# Altium schematic sheet FPGA.SchDoc
size A0
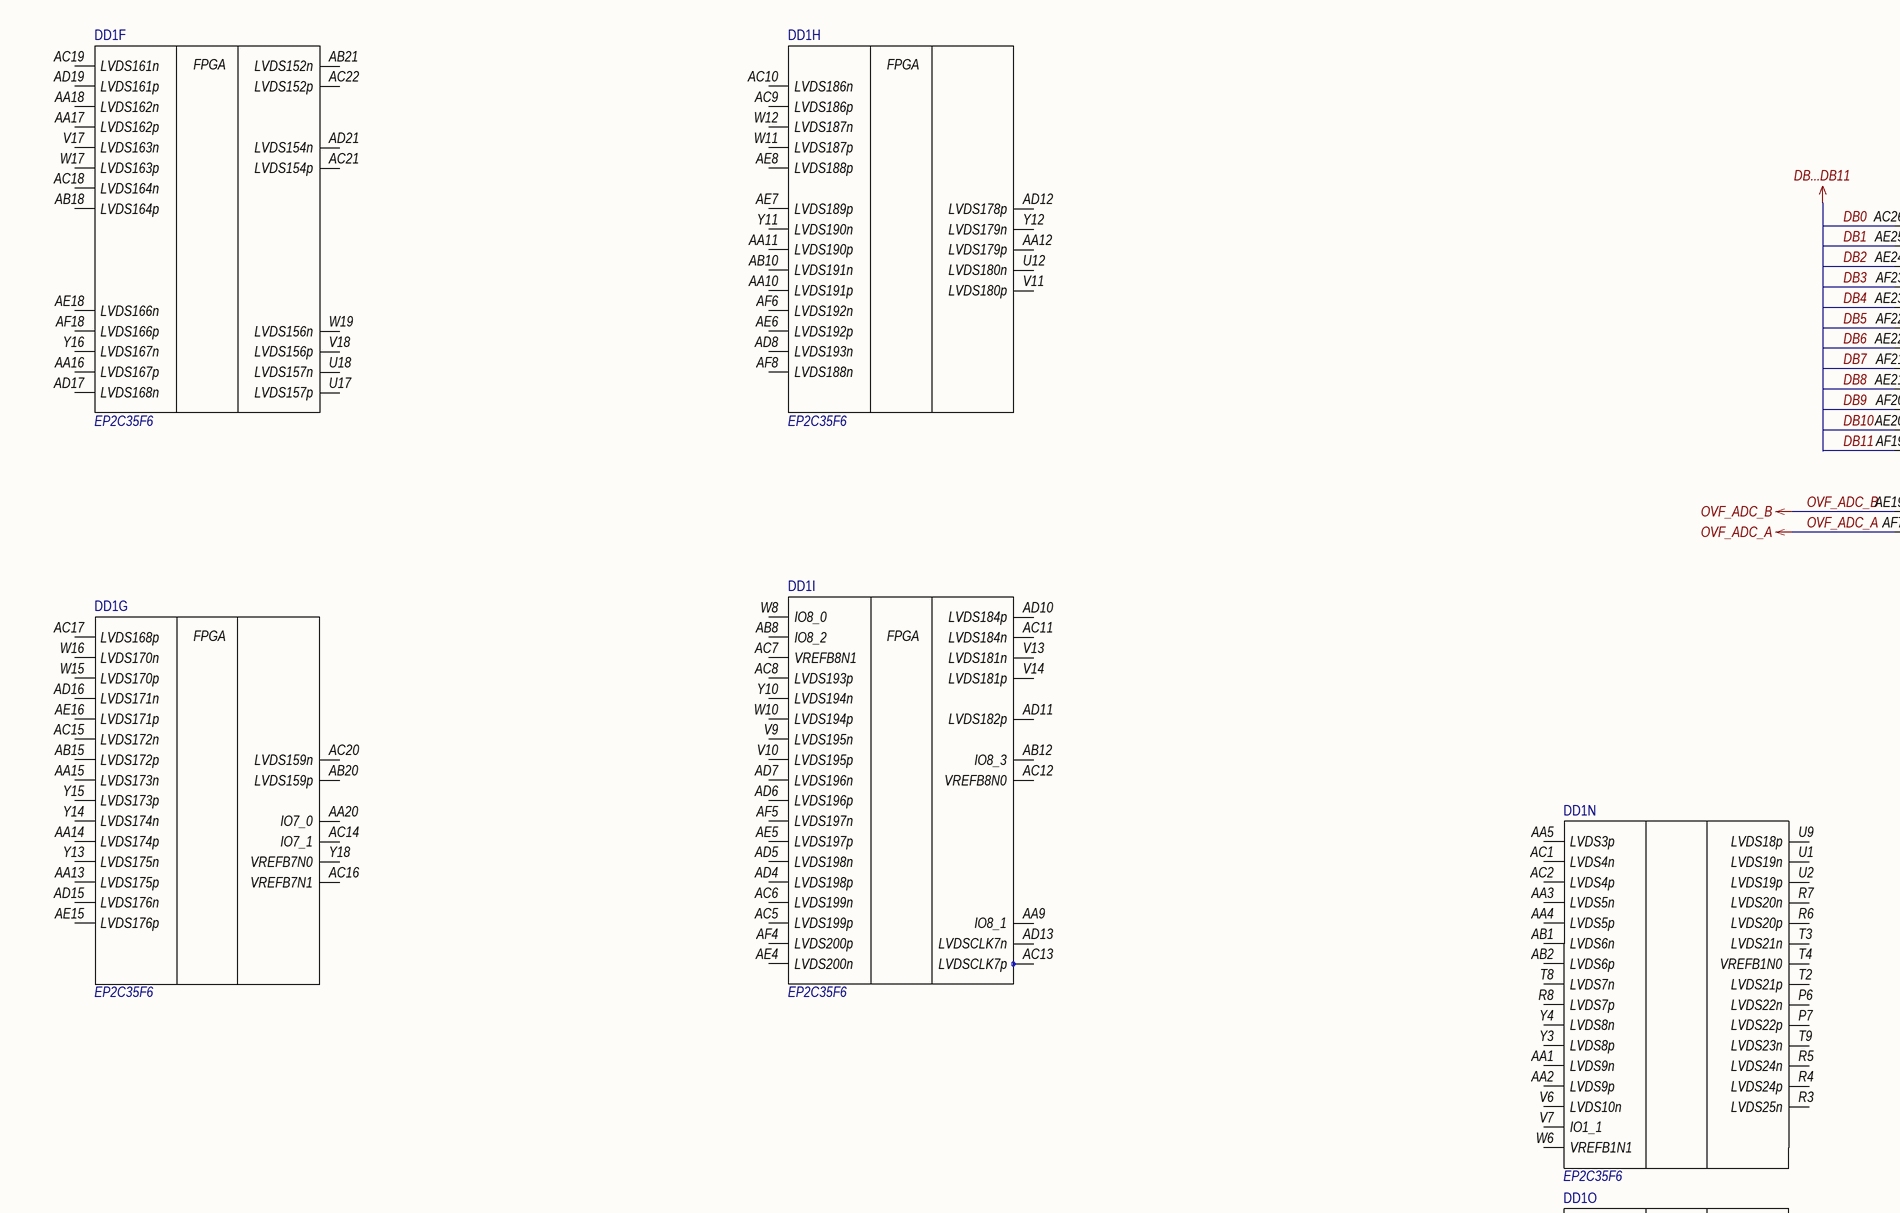
[diagram p0: FPGA.SchDoc, top left]
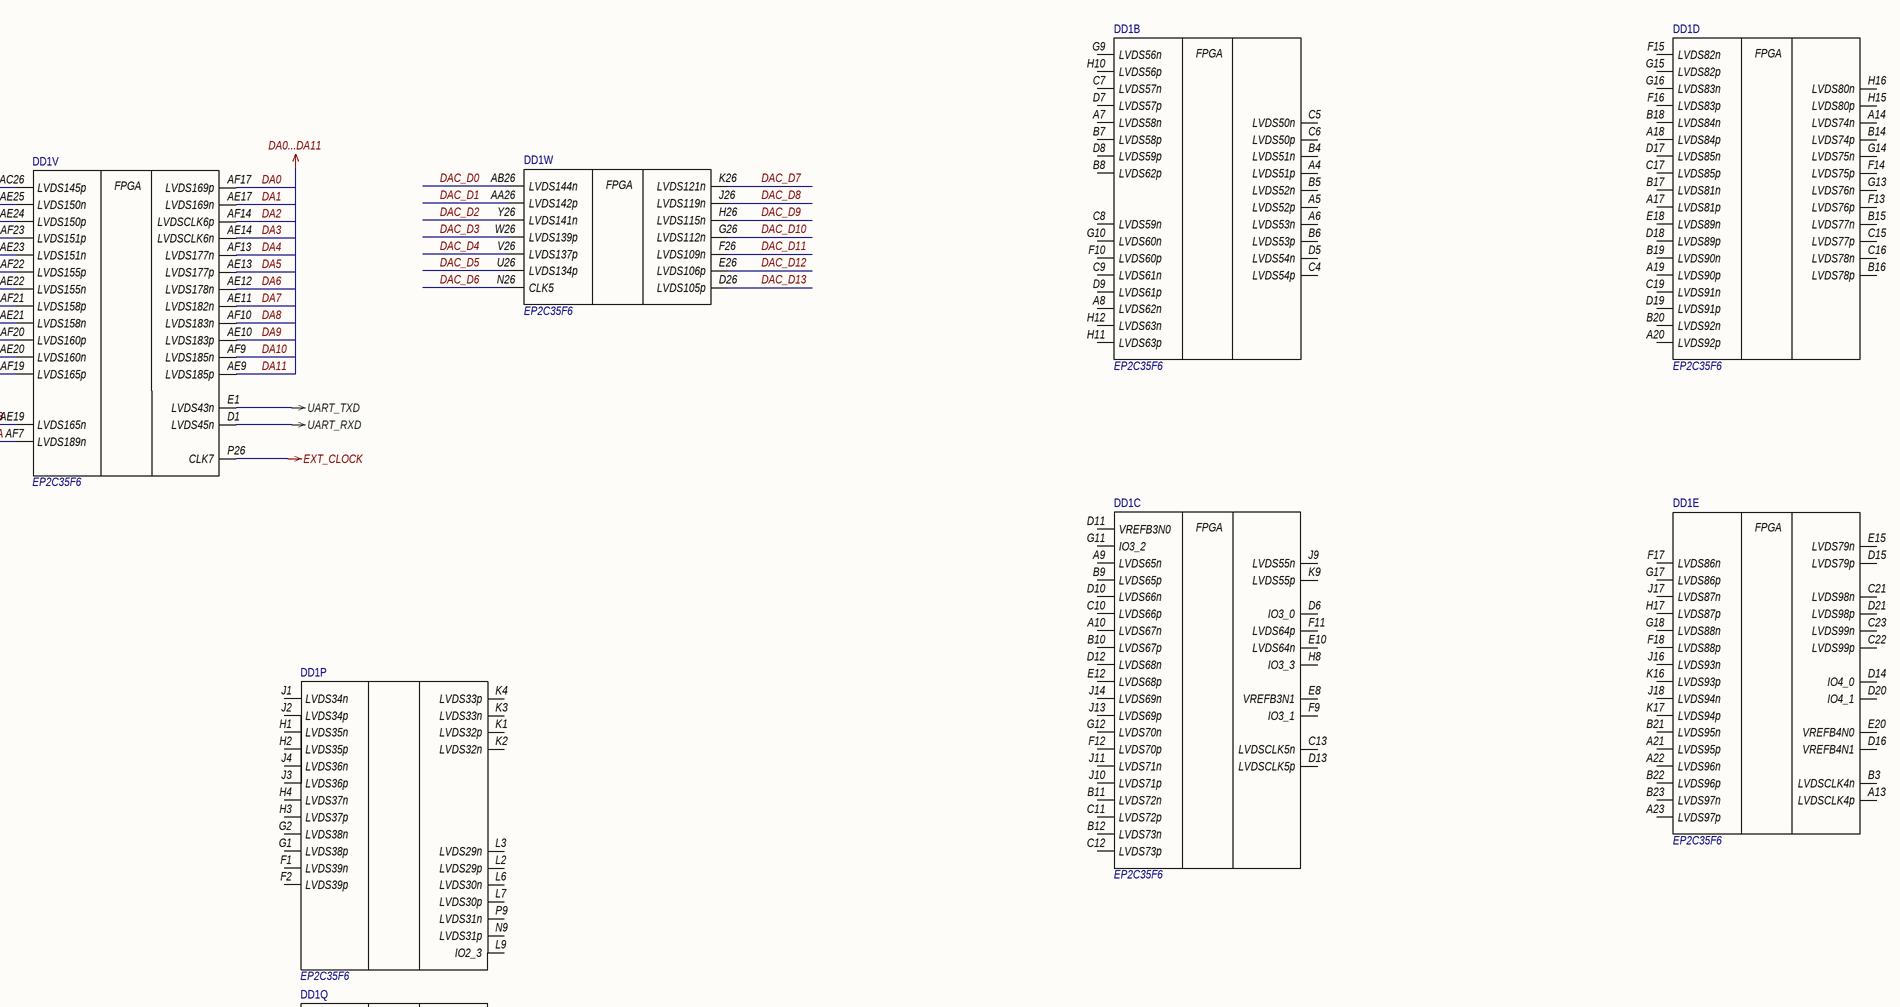
[diagram p1: FPGA.SchDoc, top right]
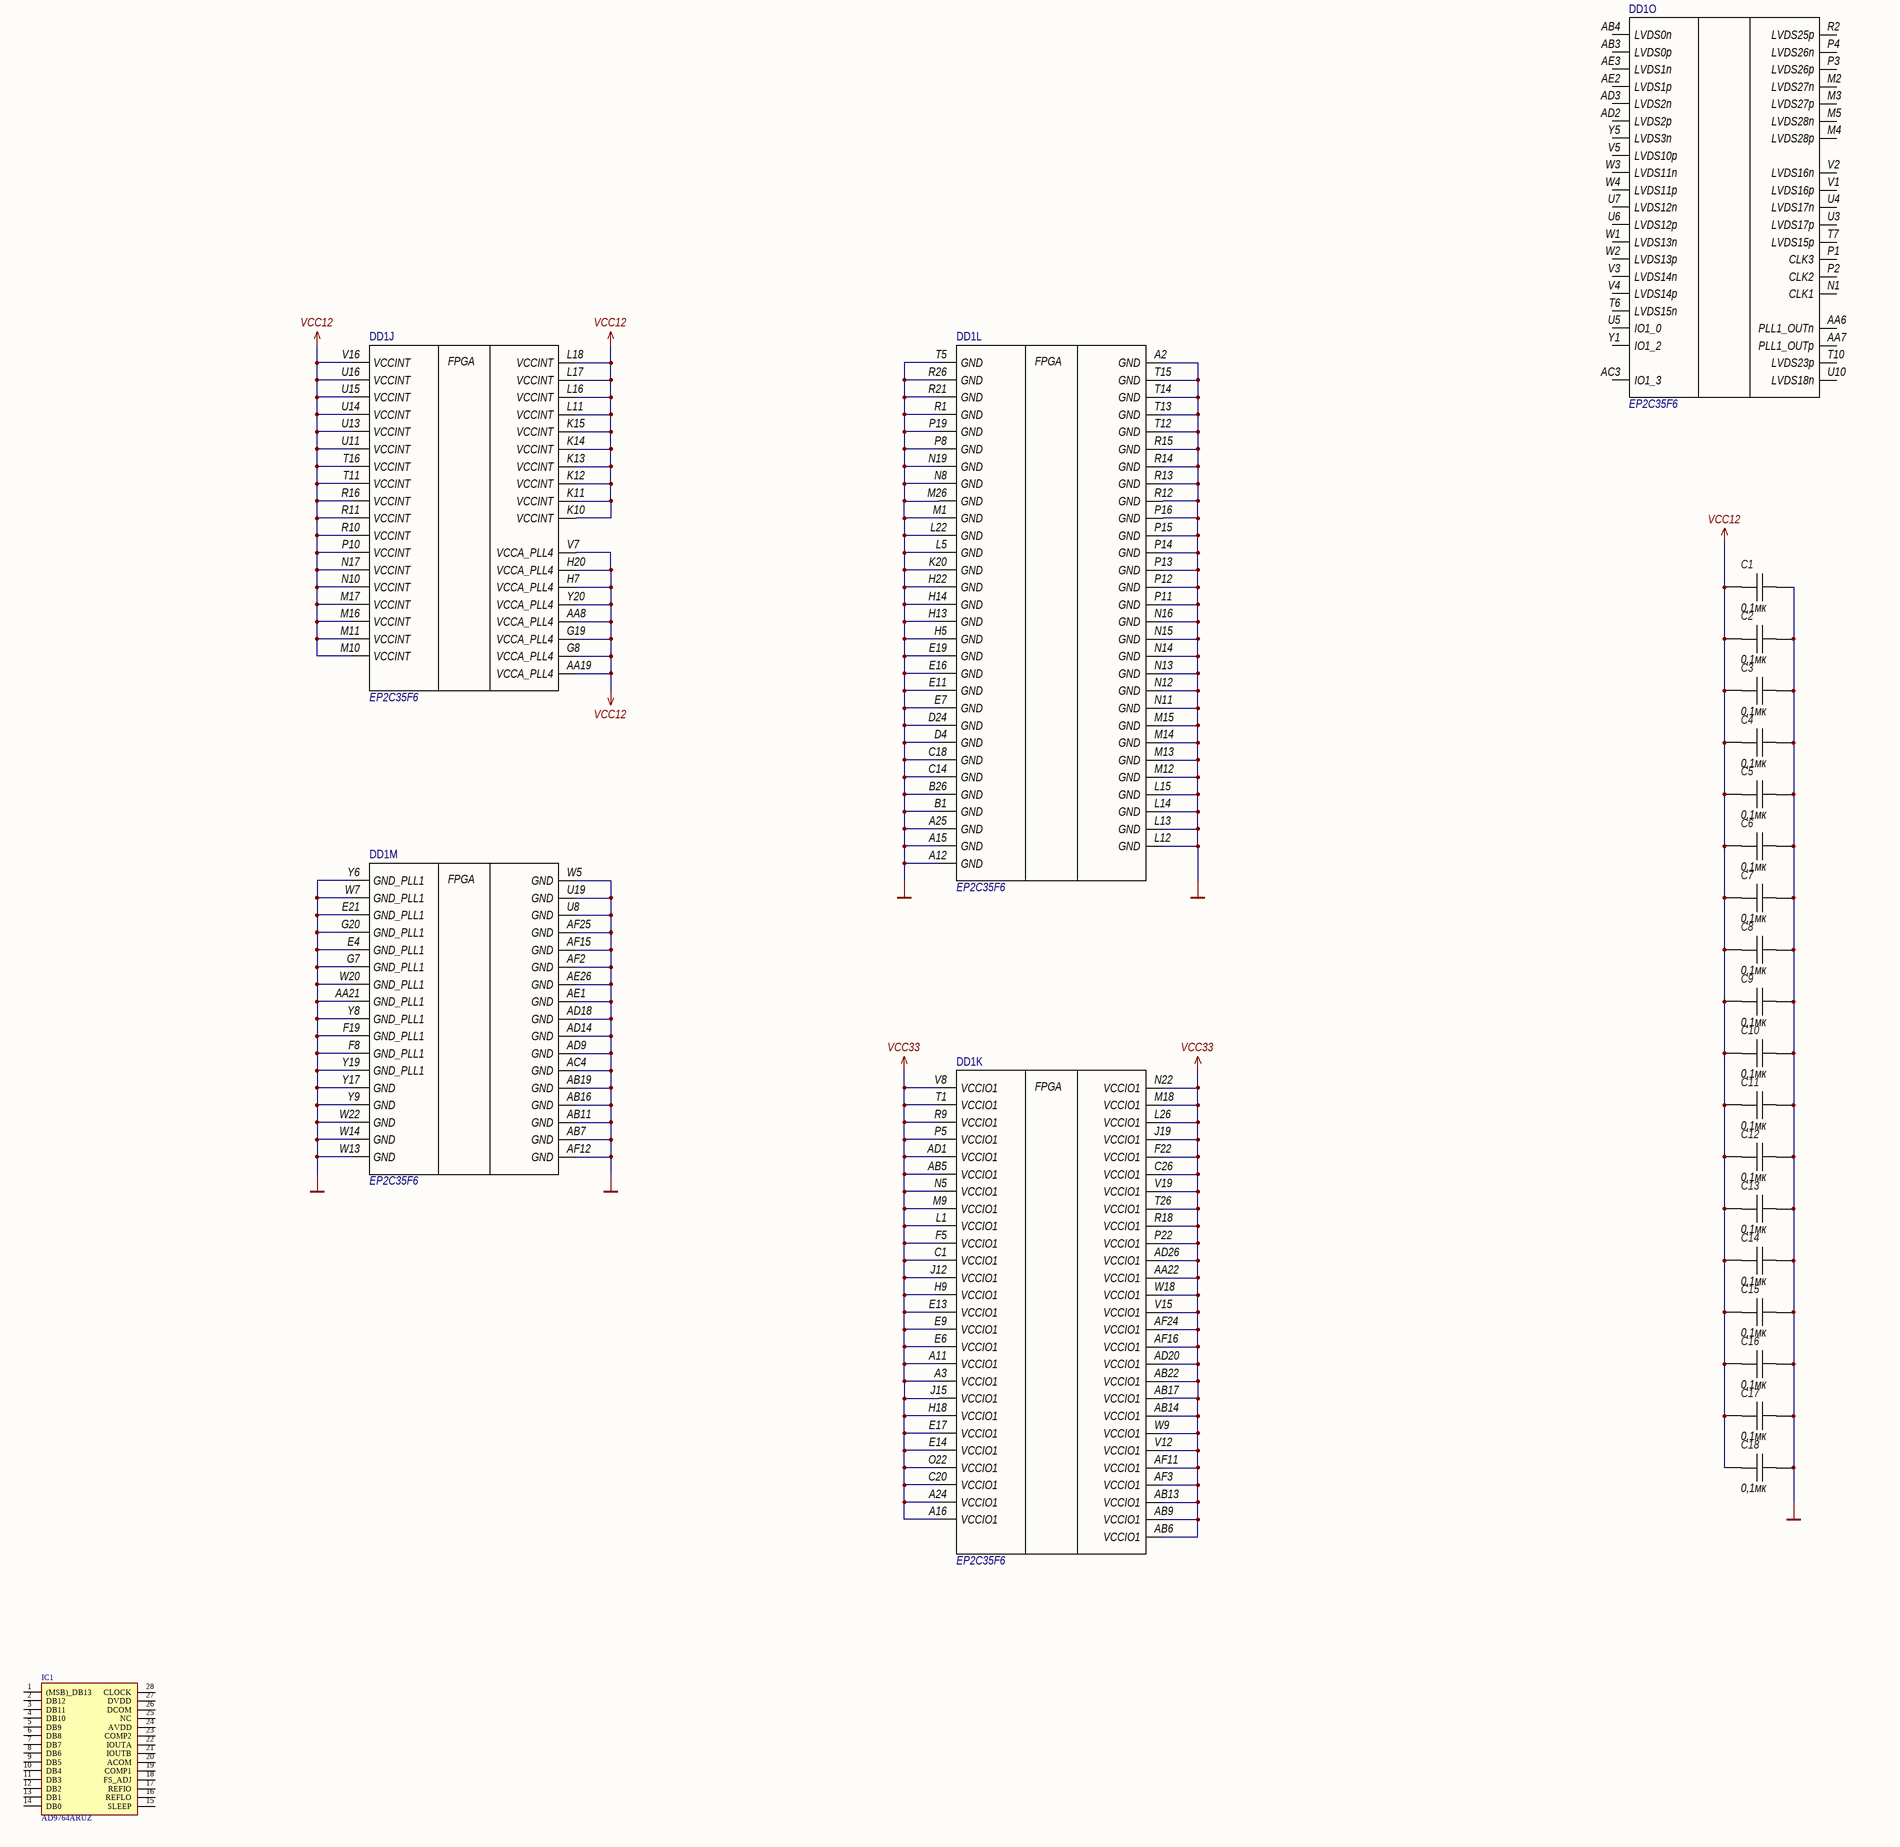
[diagram p2: FPGA.SchDoc, bottom left]
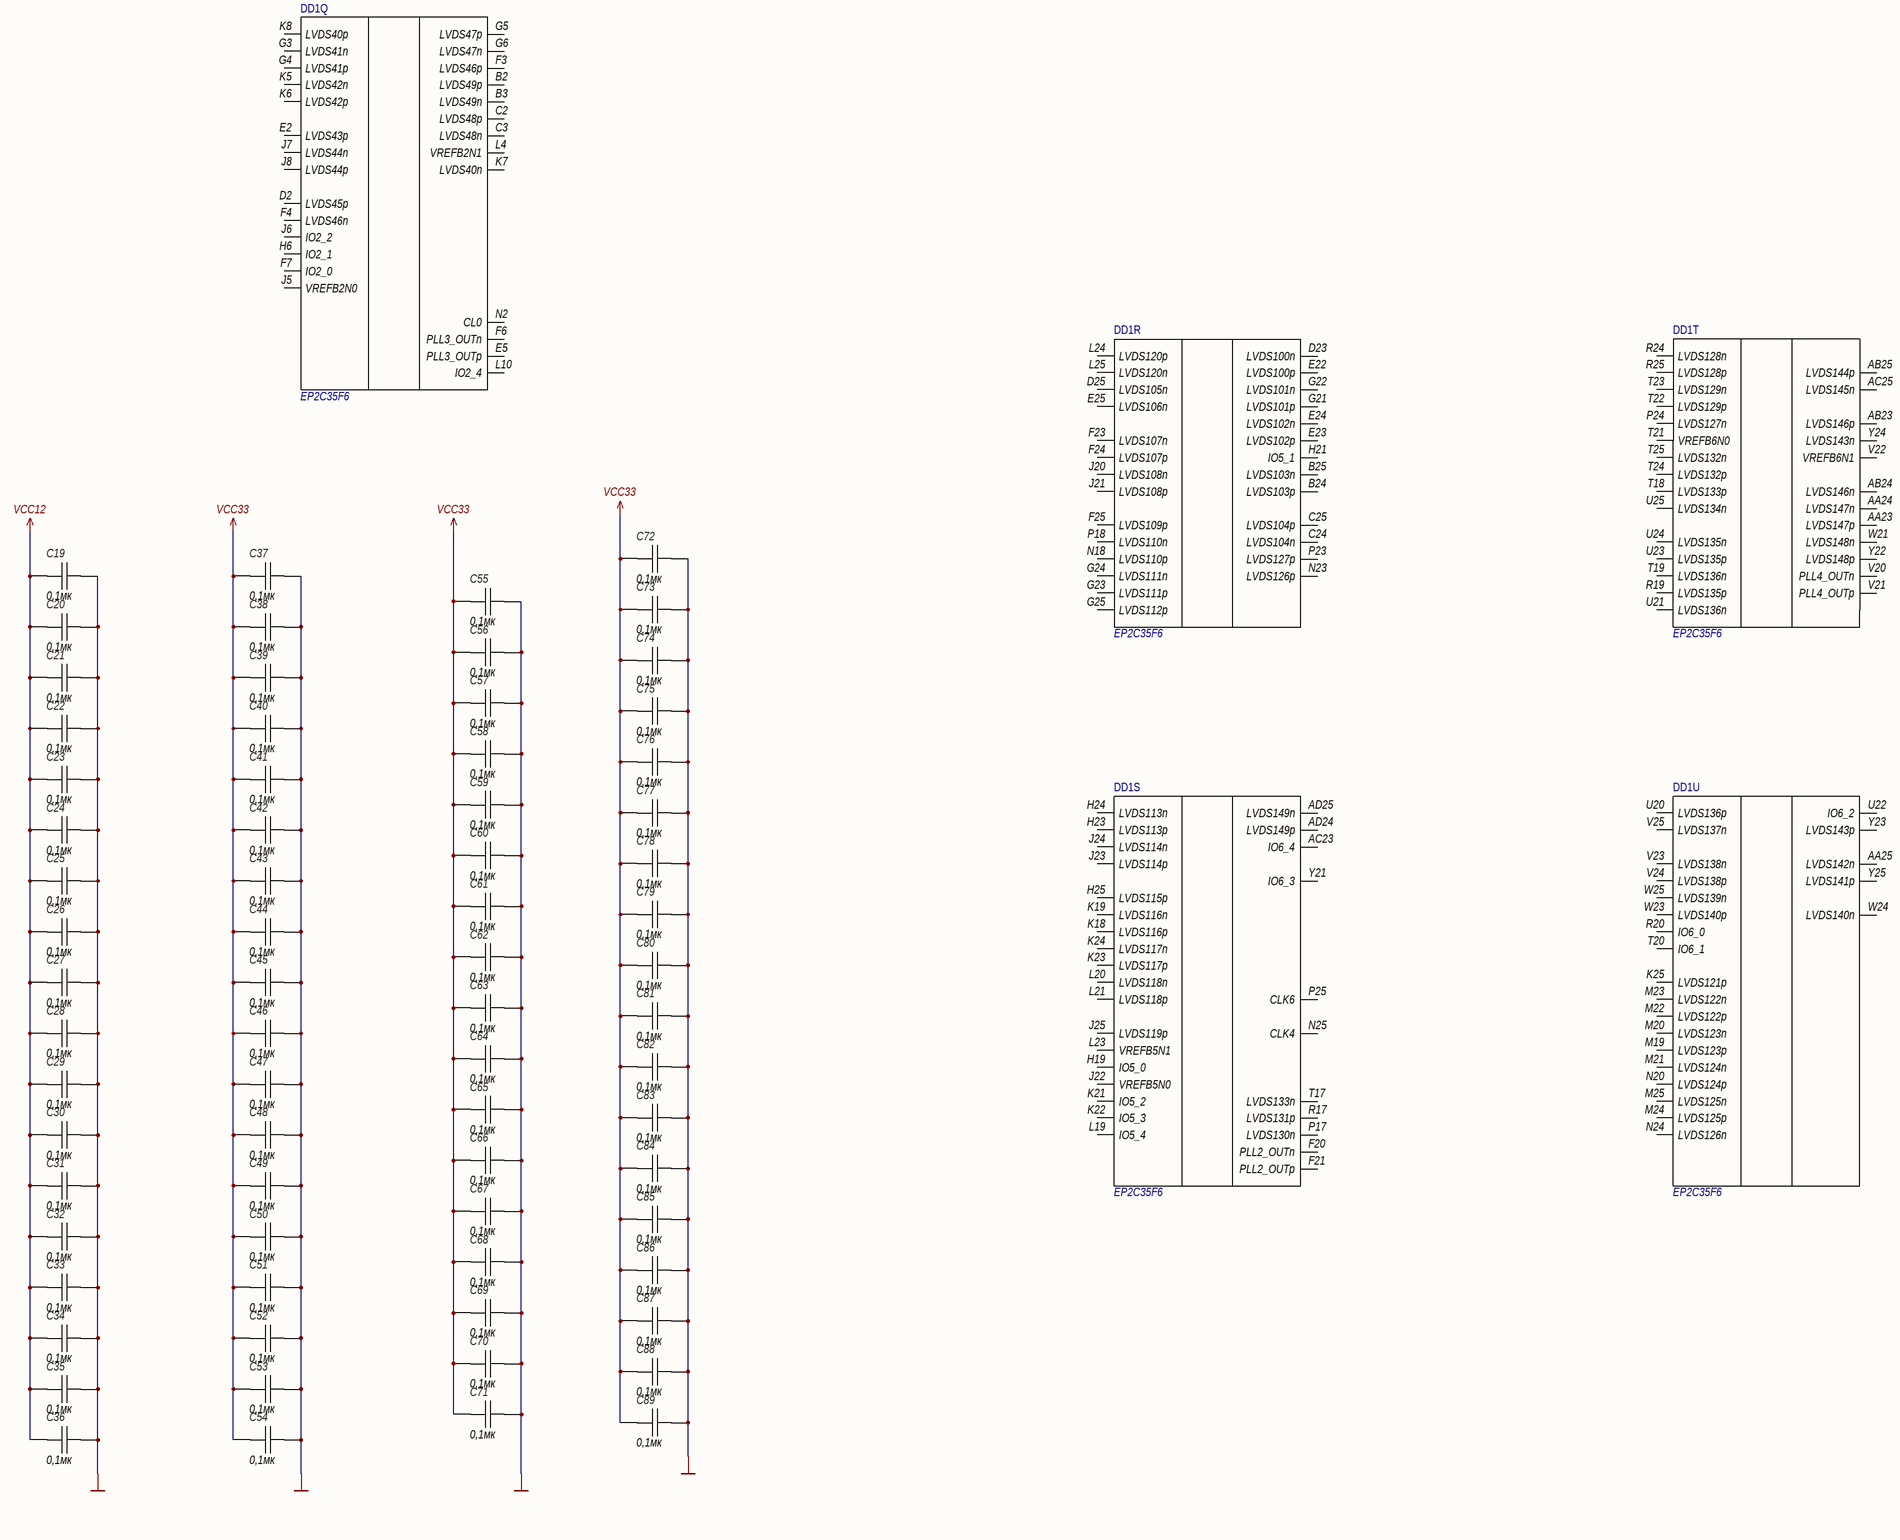
[diagram p3: FPGA.SchDoc, bottom right]

## Parts
C1  0,1мк  [RESC1005X35N]
C2  0,1мк  [RESC1005X35N]
C3  0,1мк  [RESC1005X35N]
C4  0,1мк  [RESC1005X35N]
C5  0,1мк  [RESC1005X35N]
C6  0,1мк  [RESC1005X35N]
C7  0,1мк  [RESC1005X35N]
C8  0,1мк  [RESC1005X35N]
C9  0,1мк  [RESC1005X35N]
C10  0,1мк  [RESC1005X35N]
C11  0,1мк  [RESC1005X35N]
C12  0,1мк  [RESC1005X35N]
C13  0,1мк  [RESC1005X35N]
C14  0,1мк  [RESC1005X35N]
C15  0,1мк  [RESC1005X35N]
C16  0,1мк  [RESC1005X35N]
C17  0,1мк  [RESC1005X35N]
C18  0,1мк  [RESC1005X35N]
C19  0,1мк  [RESC1005X35N]
C20  0,1мк  [RESC1005X35N]
C21  0,1мк  [RESC1005X35N]
C22  0,1мк  [RESC1005X35N]
C23  0,1мк  [RESC1005X35N]
C24  0,1мк  [RESC1005X35N]
C25  0,1мк  [RESC1005X35N]
C26  0,1мк  [RESC1005X35N]
C27  0,1мк  [RESC1005X35N]
C28  0,1мк  [RESC1005X35N]
C29  0,1мк  [RESC1005X35N]
C30  0,1мк  [RESC1005X35N]
C31  0,1мк  [RESC1005X35N]
C32  0,1мк  [RESC1005X35N]
C33  0,1мк  [RESC1005X35N]
C34  0,1мк  [RESC1005X35N]
C35  0,1мк  [RESC1005X35N]
C36  0,1мк  [RESC1005X35N]
C37  0,1мк  [RESC1005X35N]
C38  0,1мк  [RESC1005X35N]
C39  0,1мк  [RESC1005X35N]
C40  0,1мк  [RESC1005X35N]
C41  0,1мк  [RESC1005X35N]
C42  0,1мк  [RESC1005X35N]
C43  0,1мк  [RESC1005X35N]
C44  0,1мк  [RESC1005X35N]
C45  0,1мк  [RESC1005X35N]
C46  0,1мк  [RESC1005X35N]
C47  0,1мк  [RESC1005X35N]
C48  0,1мк  [RESC1005X35N]
C49  0,1мк  [RESC1005X35N]
C50  0,1мк  [RESC1005X35N]
C51  0,1мк  [RESC1005X35N]
C52  0,1мк  [RESC1005X35N]
C53  0,1мк  [RESC1005X35N]
C54  0,1мк  [RESC1005X35N]
C55  0,1мк  [RESC1005X35N]
C56  0,1мк  [RESC1005X35N]
C57  0,1мк  [RESC1005X35N]
C58  0,1мк  [RESC1005X35N]
C59  0,1мк  [RESC1005X35N]
C60  0,1мк  [RESC1005X35N]
C61  0,1мк  [RESC1005X35N]
C62  0,1мк  [RESC1005X35N]
C63  0,1мк  [RESC1005X35N]
C64  0,1мк  [RESC1005X35N]
C65  0,1мк  [RESC1005X35N]
C66  0,1мк  [RESC1005X35N]
C67  0,1мк  [RESC1005X35N]
C68  0,1мк  [RESC1005X35N]
C69  0,1мк  [RESC1005X35N]
C70  0,1мк  [RESC1005X35N]
C71  0,1мк  [RESC1005X35N]
C72  0,1мк  [RESC1005X35N]
C73  0,1мк  [RESC1005X35N]
C74  0,1мк  [RESC1005X35N]
C75  0,1мк  [RESC1005X35N]
C76  0,1мк  [RESC1005X35N]
C77  0,1мк  [RESC1005X35N]
C78  0,1мк  [RESC1005X35N]
C79  0,1мк  [RESC1005X35N]
C80  0,1мк  [RESC1005X35N]
C81  0,1мк  [RESC1005X35N]
C82  0,1мк  [RESC1005X35N]
C83  0,1мк  [RESC1005X35N]
C84  0,1мк  [RESC1005X35N]
C85  0,1мк  [RESC1005X35N]
C86  0,1мк  [RESC1005X35N]
C87  0,1мк  [RESC1005X35N]
C88  0,1мк  [RESC1005X35N]
C89  0,1мк  [RESC1005X35N]
DD1  EP2C35F6  [BGA672CP100_26X26_2700X2700X240B60N]  (parts B,C,D,E,F,G,H,I,J,K,L,M,N,O,P,Q,R,S,T,U,V,W of 23)
IC1  AD9764ARUZ  [SOP65P640X120-28N]

## Nets
EXT_CLOCK: DD1.P26(CLK7)
GND: C1.2 C2.2 C3.2 C4.2 C5.2 C6.2 C7.2 C8.2 C9.2 C10.2 C11.2 C12.2 C13.2 C14.2 C15.2 C16.2 C17.2 C18.2 C19.2 C20.2 C21.2 C22.2 C23.2 C24.2 C25.2 C26.2 C27.2 C28.2 C29.2 C30.2 C31.2 C32.2 C33.2 C34.2 C35.2 C36.2 C37.2 C38.2 C39.2 C40.2 C41.2 C42.2 C43.2 C44.2 C45.2 C46.2 C47.2 C48.2 C49.2 C50.2 C51.2 C52.2 C53.2 C54.2 C55.2 C56.2 C57.2 C58.2 C59.2 C60.2 C61.2 C62.2 C63.2 C64.2 C65.2 C66.2 C67.2 C68.2 C69.2 C70.2 C71.2 C72.2 C73.2 C74.2 C75.2 C76.2 C77.2 C78.2 C79.2 C80.2 C81.2 C82.2 C83.2 C84.2 C85.2 C86.2 C87.2 C88.2 C89.2 DD1.A2(GND) DD1.A12(GND) DD1.A15(GND) DD1.A25(GND) DD1.AA21(GND_PLL1) DD1.AB7(GND) DD1.AB11(GND) DD1.AB16(GND) DD1.AB19(GND) DD1.AC4(GND) DD1.AD9(GND) DD1.AD14(GND) DD1.AD18(GND) DD1.AE1(GND) DD1.AE26(GND) DD1.AF2(GND) DD1.AF12(GND) DD1.AF15(GND) DD1.AF25(GND) DD1.B1(GND) DD1.B26(GND) DD1.C14(GND) DD1.C18(GND) DD1.D4(GND) DD1.D24(GND) DD1.E4(GND_PLL1) DD1.E7(GND) DD1.E11(GND) DD1.E16(GND) DD1.E19(GND) DD1.E21(GND_PLL1) DD1.F8(GND_PLL1) DD1.F19(GND_PLL1) DD1.G7(GND_PLL1) DD1.G20(GND_PLL1) DD1.H5(GND) DD1.H13(GND) DD1.H14(GND) DD1.H22(GND) DD1.K20(GND) DD1.L5(GND) DD1.L12(GND) DD1.L13(GND) DD1.L14(GND) DD1.L15(GND) DD1.L22(GND) DD1.M1(GND) DD1.M12(GND) DD1.M13(GND) DD1.M14(GND) DD1.M15(GND) DD1.M26(GND) DD1.N8(GND) DD1.N11(GND) DD1.N12(GND) DD1.N13(GND) DD1.N14(GND) DD1.N15(GND) DD1.N16(GND) DD1.N19(GND) DD1.P8(GND) DD1.P11(GND) DD1.P12(GND) DD1.P13(GND) DD1.P14(GND) DD1.P15(GND) DD1.P16(GND) DD1.P19(GND) DD1.R1(GND) DD1.R12(GND) DD1.R13(GND) DD1.R14(GND) DD1.R15(GND) DD1.R21(GND) DD1.R26(GND) DD1.T5(GND) DD1.T12(GND) DD1.T13(GND) DD1.T14(GND) DD1.T15(GND) DD1.U8(GND) DD1.U19(GND) DD1.W5(GND) DD1.W7(GND_PLL1) DD1.W13(GND) DD1.W14(GND) DD1.W20(GND_PLL1) DD1.W22(GND) DD1.Y6(GND_PLL1) DD1.Y8(GND_PLL1) DD1.Y9(GND) DD1.Y17(GND) DD1.Y19(GND_PLL1)
OVF_ADC_A: DD1.AF7(LVDS189n)
OVF_ADC_B: DD1.AE19(LVDS165n)
UART_RXD: DD1.D1(LVDS45n)
UART_TXD: DD1.E1(LVDS43n)
VCC12: C1.1 C2.1 C3.1 C4.1 C5.1 C6.1 C7.1 C8.1 C9.1 C10.1 C11.1 C12.1 C13.1 C14.1 C15.1 C16.1 C17.1 C18.1 C19.1 C20.1 C21.1 C22.1 C23.1 C24.1 C25.1 C26.1 C27.1 C28.1 C29.1 C30.1 C31.1 C32.1 C33.1 C34.1 C35.1 C36.1 DD1.AA8(VCCA_PLL4) DD1.AA19(VCCA_PLL4) DD1.G8(VCCA_PLL4) DD1.G19(VCCA_PLL4) DD1.H7(VCCA_PLL4) DD1.H20(VCCA_PLL4) DD1.K10(VCCINT) DD1.K11(VCCINT) DD1.K12(VCCINT) DD1.K13(VCCINT) DD1.K14(VCCINT) DD1.K15(VCCINT) DD1.L11(VCCINT) DD1.L16(VCCINT) DD1.L17(VCCINT) DD1.L18(VCCINT) DD1.M10(VCCINT) DD1.M11(VCCINT) DD1.M16(VCCINT) DD1.M17(VCCINT) DD1.N10(VCCINT) DD1.N17(VCCINT) DD1.P10(VCCINT) DD1.R10(VCCINT) DD1.R11(VCCINT) DD1.R16(VCCINT) DD1.T11(VCCINT) DD1.T16(VCCINT) DD1.U11(VCCINT) DD1.U13(VCCINT) DD1.U14(VCCINT) DD1.U15(VCCINT) DD1.U16(VCCINT) DD1.V7(VCCA_PLL4) DD1.V16(VCCINT) DD1.Y20(VCCA_PLL4)
VCC33: C37.1 C38.1 C39.1 C40.1 C41.1 C42.1 C43.1 C44.1 C45.1 C46.1 C47.1 C48.1 C49.1 C50.1 C51.1 C52.1 C53.1 C54.1 C55.1 C56.1 C57.1 C58.1 C59.1 C60.1 C61.1 C62.1 C63.1 C64.1 C65.1 C66.1 C67.1 C68.1 C69.1 C70.1 C71.1 C72.1 C73.1 C74.1 C75.1 C76.1 C77.1 C78.1 C79.1 C80.1 C81.1 C82.1 C83.1 C84.1 C85.1 C86.1 C87.1 C88.1 C89.1 DD1.A3(VCCIO1) DD1.A11(VCCIO1) DD1.A16(VCCIO1) DD1.A24(VCCIO1) DD1.AA22(VCCIO1) DD1.AB5(VCCIO1) DD1.AB6(VCCIO1) DD1.AB9(VCCIO1) DD1.AB13(VCCIO1) DD1.AB14(VCCIO1) DD1.AB17(VCCIO1) DD1.AB22(VCCIO1) DD1.AD1(VCCIO1) DD1.AD20(VCCIO1) DD1.AD26(VCCIO1) DD1.AF3(VCCIO1) DD1.AF11(VCCIO1) DD1.AF16(VCCIO1) DD1.AF24(VCCIO1) DD1.C1(VCCIO1) DD1.C20(VCCIO1) DD1.C26(VCCIO1) DD1.E6(VCCIO1) DD1.E9(VCCIO1) DD1.E13(VCCIO1) DD1.E14(VCCIO1) DD1.E17(VCCIO1) DD1.F5(VCCIO1) DD1.F22(VCCIO1) DD1.H9(VCCIO1) DD1.H18(VCCIO1) DD1.J12(VCCIO1) DD1.J15(VCCIO1) DD1.J19(VCCIO1) DD1.L1(VCCIO1) DD1.L26(VCCIO1) DD1.M9(VCCIO1) DD1.M18(VCCIO1) DD1.N5(VCCIO1) DD1.N22(VCCIO1) DD1.O22(VCCIO1) DD1.P5(VCCIO1) DD1.P22(VCCIO1) DD1.R9(VCCIO1) DD1.R18(VCCIO1) DD1.T1(VCCIO1) DD1.T26(VCCIO1) DD1.V8(VCCIO1) DD1.V12(VCCIO1) DD1.V15(VCCIO1) DD1.V19(VCCIO1) DD1.W9(VCCIO1) DD1.W18(VCCIO1)
DA0: DD1.AF17(LVDS169p)
DA1: DD1.AE17(LVDS169n)
DA2: DD1.AF14(LVDSCLK6p)
DA3: DD1.AE14(LVDSCLK6n)
DA4: DD1.AF13(LVDS177n)
DA5: DD1.AE13(LVDS177p)
DA6: DD1.AE12(LVDS178n)
DA7: DD1.AE11(LVDS182n)
DA8: DD1.AF10(LVDS183n)
DA9: DD1.AE10(LVDS183p)
DA10: DD1.AF9(LVDS185n)
DA11: DD1.AE9(LVDS185p)
DAC_D0: DD1.AB26(LVDS144n)
DAC_D1: DD1.AA26(LVDS142p)
DAC_D2: DD1.Y26(LVDS141n)
DAC_D3: DD1.W26(LVDS139p)
DAC_D4: DD1.V26(LVDS137p)
DAC_D5: DD1.U26(LVDS134p)
DAC_D6: DD1.N26(CLK5)
DAC_D7: DD1.K26(LVDS121n)
DAC_D8: DD1.J26(LVDS119n)
DAC_D9: DD1.H26(LVDS115n)
DAC_D10: DD1.G26(LVDS112n)
DAC_D11: DD1.F26(LVDS109n)
DAC_D12: DD1.E26(LVDS106p)
DAC_D13: DD1.D26(LVDS105p)
DB0: DD1.AC26(LVDS145p)
DB1: DD1.AE25(LVDS150n)
DB2: DD1.AE24(LVDS150p)
DB3: DD1.AF23(LVDS151p)
DB4: DD1.AE23(LVDS151n)
DB5: DD1.AF22(LVDS155p)
DB6: DD1.AE22(LVDS155n)
DB7: DD1.AF21(LVDS158p)
DB8: DD1.AE21(LVDS158n)
DB9: DD1.AF20(LVDS160p)
DB10: DD1.AE20(LVDS160n)
DB11: DD1.AF19(LVDS165p)

Not connected (* = marked no-connect by the designer): DD1 A4(LVDS51p) A5(LVDS52p) A6(LVDS53n) A7(LVDS58n) A8(LVDS62n) A9(LVDS65n) A10(LVDS67n) A13(LVDSCLK4p) A14(LVDS74n) A17(LVDS81p) A18(LVDS84p) A19(LVDS90p) A20(LVDS92p) A21(LVDS95p) A22(LVDS96n) A23(LVDS97p) AA1(LVDS9n) AA2(LVDS9p) AA3(LVDS5n) AA4(LVDS5p) AA5(LVDS3p) AA6(PLL1_OUTn) AA7(PLL1_OUTp) AA9(IO8_1) AA10(LVDS191p) AA11(LVDS190p) AA12(LVDS179p) AA13(LVDS175p) AA14(LVDS174p) AA15(LVDS173n) AA16(LVDS167p) AA17(LVDS162p) AA18(LVDS162n) AA20(IO7_0) AA23(LVDS147p) AA24(LVDS147n) AA25(LVDS142n) AB1(LVDS6n) AB2(LVDS6p) AB3(LVDS0p) AB4(LVDS0n) AB8(IO8_2) AB10(LVDS191n) AB12(IO8_3) AB15(LVDS172p) AB18(LVDS164p) AB20(LVDS159p) AB21(LVDS152n) AB23(LVDS146p) AB24(LVDS146n) AB25(LVDS144p) AC1(LVDS4n) AC2(LVDS4p) AC3(IO1_3) AC5(LVDS199p) AC6(LVDS199n) AC7(VREFB8N1) AC8(LVDS193p) AC9(LVDS186p) AC10(LVDS186n) AC11(LVDS184n) AC12(VREFB8N0) AC13(LVDSCLK7p) AC14(IO7_1) AC15(LVDS172n) AC16(VREFB7N1) AC17(LVDS168p) AC18(LVDS164n) AC19(LVDS161n) AC20(LVDS159n) AC21(LVDS154p) AC22(LVDS152p) AC23(IO6_4) AC25(LVDS145n) AD2(LVDS2p) AD3(LVDS2n) AD4(LVDS198p) AD5(LVDS198n) AD6(LVDS196p) AD7(LVDS196n) AD8(LVDS193n) AD10(LVDS184p) AD11(LVDS182p) AD12(LVDS178p) AD13(LVDSCLK7n) AD15(LVDS176n) AD16(LVDS171n) AD17(LVDS168n) AD19(LVDS161p) AD21(LVDS154n) AD24(LVDS149p) AD25(LVDS149n) AE2(LVDS1p) AE3(LVDS1n) AE4(LVDS200n) AE5(LVDS197p) AE6(LVDS192p) AE7(LVDS189p) AE8(LVDS188p) AE15(LVDS176p) AE16(LVDS171p) AE18(LVDS166n) AF4(LVDS200p) AF5(LVDS197n) AF6(LVDS192n) AF8(LVDS188n) AF18(LVDS166p) B2(LVDS49p) B3(LVDSCLK4n) B4(LVDS51n) B5(LVDS52n) B6(LVDS53p) B7(LVDS58p) B8(LVDS62p) B9(LVDS65p) B10(LVDS67p) B11(LVDS72n) B12(LVDS73n) B14(LVDS74p) B15(LVDS77n) B16(LVDS78p) B17(LVDS81n) B18(LVDS84n) B19(LVDS90n) B20(LVDS92n) B21(LVDS95n) B22(LVDS96p) B23(LVDS97n) B24(LVDS103p) B25(LVDS103n) C2(LVDS48p) C3(LVDS48n) C4(LVDS54p) C5(LVDS50n) C6(LVDS50p) C7(LVDS57n) C8(LVDS59n) C9(LVDS61n) C10(LVDS66p) C11(LVDS72p) C12(LVDS73p) C13(LVDSCLK5n) C16(LVDS78n) C17(LVDS85p) C19(LVDS91n) C21(LVDS98n) C22(LVDS99p) C23(LVDS99n) C24(LVDS104n) C25(LVDS104p) D2(LVDS45p) D5(LVDS54n) D6(IO3_0) D7(LVDS57p) D8(LVDS59p) D9(LVDS61p) D10(LVDS66n) D11(VREFB3N0) D12(LVDS68n) D13(LVDSCLK5p) D14(IO4_0) D15(LVDS79p) D16(VREFB4N1) D17(LVDS85n) D18(LVDS89p) D19(LVDS91p) D20(IO4_1) D21(LVDS98p) D23(LVDS100n) D25(LVDS105n) E2(LVDS43p) E5(PLL3_OUTp) E8(VREFB3N1) E10(LVDS64n) E12(LVDS68p) E15(LVDS79n) E18(LVDS89n) E20(VREFB4N0) E22(LVDS100p) E23(LVDS102p) E24(LVDS102n) E25(LVDS106n) F1(LVDS39n) F2(LVDS39p) F3(LVDS46p) F4(LVDS46n) F6(PLL3_OUTn) F7(IO2_0) F9(IO3_1) F10(LVDS60p) F11(LVDS64p) F12(LVDS70p) F13(LVDS76p) F14(LVDS75p) F15(LVDS82n) F16(LVDS83p) F17(LVDS86n) F18(LVDS88p) F20(PLL2_OUTn) F21(PLL2_OUTp) F23(LVDS107n) F24(LVDS107p) F25(LVDS109p) G1(LVDS38p) G2(LVDS38n) G3(LVDS41n) G4(LVDS41p) G5(LVDS47p) G6(LVDS47n) G9(LVDS56n) G10(LVDS60n) G11(IO3_2) G12(LVDS70n) G13(LVDS76n) G14(LVDS75n) G15(LVDS82p) G16(LVDS83n) G17(LVDS86p) G18(LVDS88n) G21(LVDS101p) G22(LVDS101n) G23(LVDS111p) G24(LVDS111n) G25(LVDS112p) H1(LVDS35n) H2(LVDS35p) H3(LVDS37p) H4(LVDS37n) H6(IO2_1) H8(IO3_3) H10(LVDS56p) H11(LVDS63p) H12(LVDS63n) H15(LVDS80p) H16(LVDS80n) H17(LVDS87p) H19(IO5_0) H21(IO5_1) H23(LVDS113p) H24(LVDS113n) H25(LVDS115p) J1(LVDS34n) J2(LVDS34p) J3(LVDS36p) J4(LVDS36n) J5(VREFB2N0) J6(IO2_2) J7(LVDS44n) J8(LVDS44p) J9(LVDS55n) J10(LVDS71p) J11(LVDS71n) J13(LVDS69p) J14(LVDS69n) J16(LVDS93n) J17(LVDS87n) J18(LVDS94n) J20(LVDS108n) J21(LVDS108p) J22(VREFB5N0) J23(LVDS114p) J24(LVDS114n) J25(LVDS119p) K1(LVDS32p) K2(LVDS32n) K3(LVDS33n) K4(LVDS33p) K5(LVDS42n) K6(LVDS42p) K7(LVDS40n) K8(LVDS40p) K9(LVDS55p) K16(LVDS93p) K17(LVDS94p) K18(LVDS116p) K19(LVDS116n) K21(IO5_2) K22(IO5_3) K23(LVDS117p) K24(LVDS117n) K25(LVDS121p) L2(LVDS29p) L3(LVDS29n) L4(VREFB2N1) L6(LVDS30n) L7(LVDS30p) L9(IO2_3) L10(IO2_4) L19(IO5_4) L20(LVDS118n) L21(LVDS118p) L23(VREFB5N1) L24(LVDS120p) L25(LVDS120n) M2(LVDS27n) M3(LVDS27p) M4(LVDS28p) M5(LVDS28n) M19(LVDS123p) M20(LVDS123n) M21(LVDS124n) M22(LVDS122p) M23(LVDS122n) M24(LVDS125p) M25(LVDS125n) N1(CLK1) N2(CL0) N9(LVDS31p) N18(LVDS110p) N20(LVDS124p) N23(LVDS126p) N24(LVDS126n) N25(CLK4) P1(CLK3) P2(CLK2) P3(LVDS26p) P4(LVDS26n) P6(LVDS22n) P7(LVDS22p) P9(LVDS31n) P17(LVDS130n) P18(LVDS110n) P23(LVDS127p) P24(LVDS127n) P25(CLK6) R2(LVDS25p) R3(LVDS25n) R4(LVDS24p) R5(LVDS24n) R6(LVDS20p) R7(LVDS20n) R8(LVDS7p) R17(LVDS131p) R19(LVDS135p) R20(IO6_0) R24(LVDS128n) R25(LVDS128p) T2(LVDS21p) T3(LVDS21n) T4(VREFB1N0) T6(LVDS15n) T7(LVDS15p) T8(LVDS7n) T9(LVDS23n) T10(LVDS23p) T17(LVDS133n) T18(LVDS133p) T19(LVDS136n) T20(IO6_1) T21(VREFB6N0) T22(LVDS129p) T23(LVDS129n) T24(LVDS132p) T25(LVDS132n) U1(LVDS19n) U2(LVDS19p) U3(LVDS17p) U4(LVDS17n) U5(IO1_0) U6(LVDS12p) U7(LVDS12n) U9(LVDS18p) U10(LVDS18n) U12(LVDS180n) U17(LVDS157p) U18(LVDS157n) U20(LVDS136p) U21(LVDS136n) U22(IO6_2) U23(LVDS135p) U24(LVDS135n) U25(LVDS134n) V1(LVDS16p) V2(LVDS16n) V3(LVDS14n) V4(LVDS14p) V5(LVDS10p) V6(LVDS10n) V9(LVDS195n) V10(LVDS195p) V11(LVDS180p) V13(LVDS181n) V14(LVDS181p) V17(LVDS163n) V18(LVDS156p) V20(PLL4_OUTn) V21(PLL4_OUTp) V22(VREFB6N1) V23(LVDS138n) V24(LVDS138p) V25(LVDS137n) W1(LVDS13n) W2(LVDS13p) W3(LVDS11n) W4(LVDS11p) W6(VREFB1N1) W8(IO8_0) W10(LVDS194p) W11(LVDS187p) W12(LVDS187n) W15(LVDS170p) W16(LVDS170n) W17(LVDS163p) W19(LVDS156n) W21(LVDS148n) W23(LVDS140p) W24(LVDS140n) W25(LVDS139n) Y1(IO1_2) Y3(LVDS8p) Y4(LVDS8n) Y5(LVDS3n) Y10(LVDS194n) Y11(LVDS190n) Y12(LVDS179n) Y13(LVDS175n) Y14(LVDS174n) Y15(LVDS173p) Y16(LVDS167n) Y18(VREFB7N0) Y21(IO6_3) Y22(LVDS148p) Y23(LVDS143p) Y24(LVDS143n) Y25(LVDS141p) С15(LVDS77p); IC1 1((MSB)_DB13) 2(DB12) 3(DB11) 4(DB10) 5(DB9) 6(DB8) 7(DB7) 8(DB6) 9(DB5) 10(DB4) 11(DB3) 12(DB2) 13(DB1) 14(DB0) 15(SLEEP) 16(REFLO) 17(REFIO) 18(FS_ADJ) 19(COMP1) 20(ACOM) 21(IOUTB) 22(IOUTA) 23(COMP2) 24(AVDD) 25(NC) 26(DCOM) 27(DVDD) 28(CLOCK)

## Notes on the sheet
- Labels drawn without touching a wire or pin: DA0...DA11, DB...DB11
- Title
- Size:
- Date:
- File:
- A0
- Number:
- Time:
- Revision:
- Sheet
- of
- (in symbol PLIS, part B) FPGA
- (in symbol PLIS, part C) FPGA
- (in symbol PLIS, part D) FPGA
- (in symbol PLIS, part E) FPGA
- (in symbol PLIS, part F) FPGA
- (in symbol PLIS, part G) FPGA
- (in symbol PLIS, part H) FPGA
- (in symbol PLIS, part I) FPGA
- (in symbol PLIS, part J) FPGA
- (in symbol PLIS, part K) FPGA
- (in symbol PLIS, part L) FPGA
- (in symbol PLIS, part M) FPGA
- (in symbol PLIS, part V) FPGA
- (in symbol PLIS, part W) FPGA

## Library data of the parts
C1-C89 = Capacitor_0.1u: ValueType: Конденсатор; Value: 0,1мк; Tolerance: *; URL: *; Temp: *; Case: *; ValueManufacturer: *; ValueManufacturerPartNumber: *; ValueDescription: *; Dielectric: *; ESR: *; Voltage: *
DD1 = PLIS
IC1 = AD9764ARUZ: Integrated Circuit; Manufacturer_Name: Analog Devices; Datasheet Link: https://componentsearchengine.com/Datasheets/2/AD9764ARUZ.pdf; Height: 1.2mm; Manufacturer_Part_Number: AD9764ARUZ; Mouser Part Number: 584-AD9764ARUZ; Mouser Price/Stock: https://www.mouser.co.uk/ProductDetail/Analog-Devices/AD9764ARUZ?qs=BpaRKvA4VqGYVNJ4cPM%252B0A%3D%3D; Arrow Part Number: AD9764ARUZ; Arrow Price/Stock: https://www.arrow.com/en/products/ad9764aruz/analog-devices?region=nac